# Altium project LimeMM-X8-FMC_1v0.PrjPcb (part 5 of 7)

## Sheet 10_Clock_data_ref.SchDoc: Clock data reference
size A3; Organization: Lime Microsystems; Address1: Surrey Tech Centre; Address2: Guildford GU2 7YG; Address3: Surrey; Address4: United Kingdom; Revision: v1.0; SheetNumber: 10; SheetTotal: 11
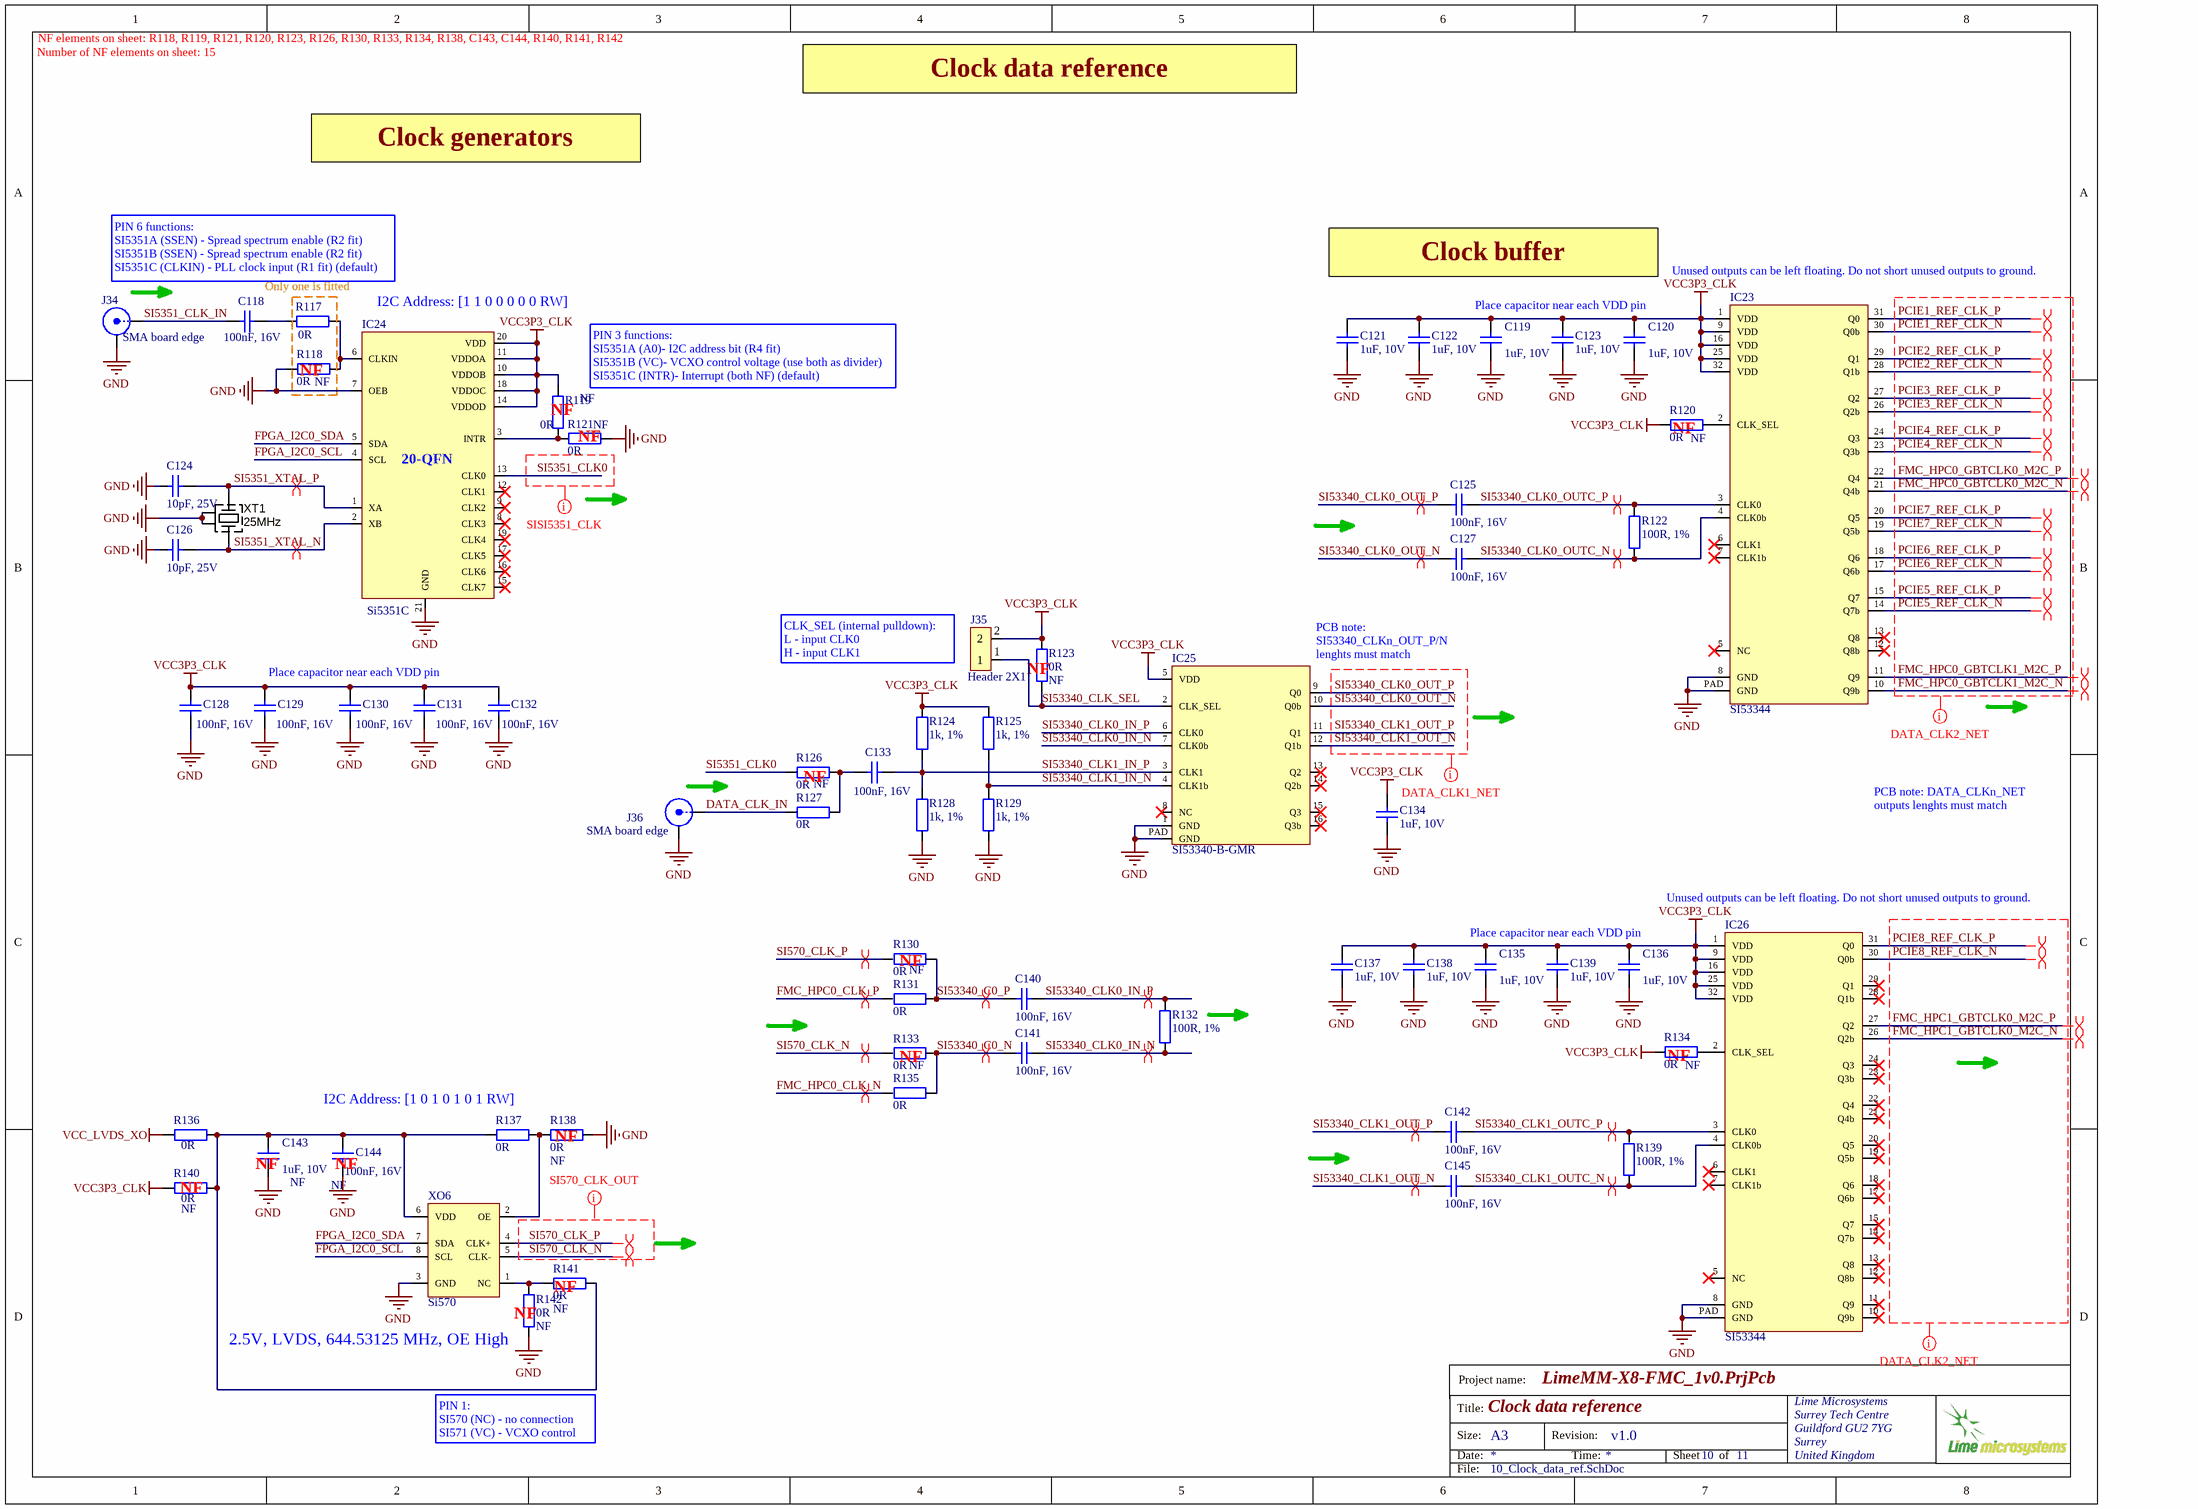
[diagram p9: 10_Clock_data_ref.SchDoc]

### Parts
C118  100nF, 16V  [CAP0402]
C119  1uF, 10V  [CAP0402]
C120  1uF, 10V  [CAP0402]
C121  1uF, 10V  [CAP0402]
C122  1uF, 10V  [CAP0402]
C123  1uF, 10V  [CAP0402]
C124  10pF, 25V  [CAP0402]
C125  100nF, 16V  [CAP0402]
C126  10pF, 25V  [CAP0402]
C127  100nF, 16V  [CAP0402]
C128  100nF, 16V  [CAP0402]
C129  100nF, 16V  [CAP0402]
C130  100nF, 16V  [CAP0402]
C131  100nF, 16V  [CAP0402]
C132  100nF, 16V  [CAP0402]
C133  100nF, 16V  [CAP0402]
C134  1uF, 10V  [CAP0402]
C135  1uF, 10V  [CAP0402]
C136  1uF, 10V  [CAP0402]
C137  1uF, 10V  [CAP0402]
C138  1uF, 10V  [CAP0402]
C139  1uF, 10V  [CAP0402]
C140  100nF, 16V  [CAP0402]
C141  100nF, 16V  [CAP0402]
C142  100nF, 16V  [CAP0402]
C143  1uF, 10V  Assembly Info: NF  [CAP0402]
C144  100nF, 16V  Assembly Info: NF  [CAP0402]
C145  100nF, 16V  [CAP0402]
IC23  SI53344  [SI53344-B-GM_32-VFQFN]
IC24  Si5351C  [Si5351C_20QFN]
IC25  SI53340-B-GMR  [SI53340_QFN16]
IC26  SI53344  [SI53344-B-GM_32-VFQFN]
J34  SMA board edge  [SMA_connector_board_edge_SM]
J35  Header 2X1  [HDR_1x2]
J36  SMA board edge  [SMA_connector_board_edge_SM]
R117  0R  [RES0402]
R118  0R  Assembly Info: NF  [RES0402]
R119  0R  Assembly Info: NF  [RES0402]
R120  0R  Assembly Info: NF  [RES0402]
R121  0R  Assembly Info: NF  [RES0402]
R122  100R, 1%  [RES0402]
R123  0R  Assembly Info: NF  [RES0402]
R124  1k, 1%  [RES0402]
R125  1k, 1%  [RES0402]
R126  0R  Assembly Info: NF  [RES0402]
R127  0R  [RES0402]
R128  1k, 1%  [RES0402]
R129  1k, 1%  [RES0402]
R130  0R  Assembly Info: NF  [RES0402]
R131  0R  [RES0402]
R132  100R, 1%  [RES0402]
R133  0R  Assembly Info: NF  [RES0402]
R134  0R  Assembly Info: NF  [RES0402]
R135  0R  [RES0402]
R136  0R  [RES0402]
R137  0R  [RES0402]
R138  0R  Assembly Info: NF  [RES0402]
R139  100R, 1%  [RES0402]
R140  0R  Assembly Info: NF  [RES0402]
R141  0R  Assembly Info: NF  [RES0402]
R142  0R  Assembly Info: NF  [RES0402]
XO6  Si570  [Si570_Si571_CRYSTAL_8SMD]
XT1  25MHz  [CRYSTAL_4-LCC]

### Nets
GND: C119.1 C120.1 C121.2 C122.2 C123.2 C124.1 C126.1 C128.2 C129.2 C130.2 C131.2 C132.2 C134.2 C135.1 C136.1 C137.2 C138.2 C139.2 C143.1 C144.2 IC23.8(GND) IC23.PAD(GND) IC24.7(OEB) IC24.21(GND) IC25.1(GND) IC25.PAD(GND) IC26.8(GND) IC26.PAD(GND) J34.2(Y) J36.2(Y) R118.2 R121.2 R128.1 R129.1 R138.1 R142.1 XO6.3(GND) XT1.2(GND) XT1.4(GND)
VCC3P3_CLK: C119.2 C120.2 C121.1 C122.1 C123.1 C128.1 C129.1 C130.1 C131.1 C132.1 C134.1 C135.2 C136.2 C137.1 C138.1 C139.1 IC23.1(VDD) IC23.9(VDD) IC23.16(VDD) IC23.25(VDD) IC23.32(VDD) IC24.10(VDDOB) IC24.11(VDDOA) IC24.14(VDDOD) IC24.18(VDDOC) IC24.20(VDD) IC25.5(VDD) IC26.1(VDD) IC26.9(VDD) IC26.16(VDD) IC26.25(VDD) IC26.32(VDD) J35.2 R119.2 R120.1 R123.1 R124.1 R125.1 R134.1 R140.2
VCC_LVDS_XO: R136.2
DATA_CLK_IN: J36.1(X) R127.2
FMC_HPC0_CLK_N: R135.2
FMC_HPC0_CLK_P: R131.2
FMC_HPC0_GBTCLK0_M2C_N: IC23.21(Q4b)
FMC_HPC0_GBTCLK0_M2C_P: IC23.22(Q4)
FMC_HPC0_GBTCLK1_M2C_N: IC23.10(Q9b)
FMC_HPC0_GBTCLK1_M2C_P: IC23.11(Q9)
FMC_HPC1_GBTCLK0_M2C_N: IC26.26(Q2b)
FMC_HPC1_GBTCLK0_M2C_P: IC26.27(Q2)
FPGA_I2C0_SCL: IC24.4(SCL) XO6.8(SCL)
FPGA_I2C0_SDA: IC24.5(SDA) XO6.7(SDA)
PCIE1_REF_CLK_N: IC23.30(Q0b)
PCIE1_REF_CLK_P: IC23.31(Q0)
PCIE2_REF_CLK_N: IC23.28(Q1b)
PCIE2_REF_CLK_P: IC23.29(Q1)
PCIE3_REF_CLK_N: IC23.26(Q2b)
PCIE3_REF_CLK_P: IC23.27(Q2)
PCIE4_REF_CLK_N: IC23.23(Q3b)
PCIE4_REF_CLK_P: IC23.24(Q3)
PCIE5_REF_CLK_N: IC23.14(Q7b)
PCIE5_REF_CLK_P: IC23.15(Q7)
PCIE6_REF_CLK_N: IC23.17(Q6b)
PCIE6_REF_CLK_P: IC23.18(Q6)
PCIE7_REF_CLK_N: IC23.19(Q5b)
PCIE7_REF_CLK_P: IC23.20(Q5)
PCIE8_REF_CLK_N: IC26.30(Q0b)
PCIE8_REF_CLK_P: IC26.31(Q0)
SI570_CLK_N: R133.2 XO6.5(CLK-)
SI570_CLK_P: R130.2 XO6.4(CLK+)
SI5351_CLK0: IC24.13(CLK0) R126.2
SI5351_CLK_IN: C118.1 J34.1(X)
SI5351_XTAL_N: C126.2 IC24.2(XB) XT1.3(X)
SI5351_XTAL_P: C124.2 IC24.1(XA) XT1.1(X)
SI53340_C0_N: C141.1 R133.1 R135.1
SI53340_C0_P: C140.1 R130.1 R131.1
SI53340_CLK0_IN_N: C141.2 IC25.7(CLK0b) R132.1
SI53340_CLK0_IN_P: C140.2 IC25.6(CLK0) R132.2
SI53340_CLK0_OUT_N: C127.1 IC25.10(Q0b)
SI53340_CLK0_OUT_P: C125.1 IC25.9(Q0)
SI53340_CLK0_OUTC_N: C127.2 IC23.4(CLK0b) R122.1
SI53340_CLK0_OUTC_P: C125.2 IC23.3(CLK0) R122.2
SI53340_CLK1_IN_N: IC25.4(CLK1b) R125.2 R129.2
SI53340_CLK1_IN_P: C133.2 IC25.3(CLK1) R124.2 R128.2
SI53340_CLK1_OUT_N: C145.1 IC25.12(Q1b)
SI53340_CLK1_OUT_P: C142.1 IC25.11(Q1)
SI53340_CLK1_OUTC_N: C145.2 IC26.4(CLK0b) R139.1
SI53340_CLK1_OUTC_P: C142.2 IC26.3(CLK0) R139.2
SI53340_CLK_SEL: IC25.2(CLK_SEL) J35.1 R123.2
NetC118_2: C118.2 R117.1
NetC133_1: C133.1 R126.1 R127.1
NetC143_2: C143.2 C144.1 R136.1 R137.2 R140.1 R141.1 XO6.6(VDD)
NetIC23_2: IC23.2(CLK_SEL) R120.2
NetIC24_3: IC24.3(INTR) R119.1 R121.1
NetIC24_6: IC24.6(CLKIN) R117.2 R118.1
NetIC26_2: IC26.2(CLK_SEL) R134.2
NetR137_1: R137.1 R138.2 XO6.2(OE)
NetR141_2: R141.2 R142.2 XO6.1(NC)

Not connected (* = marked no-connect by the designer): IC23 5(NC)* 6(CLK1)* 7(CLK1b)* 12(Q8b)* 13(Q8)*; IC24 8(CLK3)* 9(CLK2)* 12(CLK1)* 15(CLK7)* 16(CLK6)* 17(CLK5)* 19(CLK4)*; IC25 8(NC)* 13(Q2)* 14(Q2b)* 15(Q3)* 16(Q3b)*; IC26 5(NC)* 6(CLK1)* 7(CLK1b)* 10(Q9b)* 11(Q9)* 12(Q8b)* 13(Q8)* 14(Q7b)* 15(Q7)* 17(Q6b)* 18(Q6)* 19(Q5b)* 20(Q5)* 21(Q4b)* 22(Q4)* 23(Q3b)* 24(Q3)* 28(Q1b)* 29(Q1)*

### Layout directives
differential pair: FMC_HPC0_CLK_N, FMC_HPC0_CLK_P, FMC_HPC0_GBTCLK0_M2C_N, FMC_HPC0_GBTCLK0_M2C_P, FMC_HPC0_GBTCLK1_M2C_N, FMC_HPC0_GBTCLK1_M2C_P, FMC_HPC1_GBTCLK0_M2C_N, FMC_HPC1_GBTCLK0_M2C_P, PCIE1_REF_CLK_N, PCIE1_REF_CLK_P, PCIE2_REF_CLK_N, PCIE2_REF_CLK_P, PCIE3_REF_CLK_N, PCIE3_REF_CLK_P, PCIE4_REF_CLK_N, PCIE4_REF_CLK_P, PCIE5_REF_CLK_N, PCIE5_REF_CLK_P, PCIE6_REF_CLK_N, PCIE6_REF_CLK_P, PCIE7_REF_CLK_N, PCIE7_REF_CLK_P, PCIE8_REF_CLK_N, PCIE8_REF_CLK_P, SI570_CLK_N, SI570_CLK_P, SI5351_XTAL_N, SI5351_XTAL_P, SI53340_C0_N, SI53340_C0_P, SI53340_CLK0_IN_N, SI53340_CLK0_IN_P, SI53340_CLK0_OUT_N, SI53340_CLK0_OUT_P, SI53340_CLK0_OUTC_N, SI53340_CLK0_OUTC_P, SI53340_CLK1_OUT_N, SI53340_CLK1_OUT_P, SI53340_CLK1_OUTC_N, SI53340_CLK1_OUTC_P
net class SI_CLK: (no net found under the mark), SI5351_CLK0
net class DATA_CLK1_NET: SI53340_CLK0_OUT_N, SI53340_CLK0_OUT_P, SI53340_CLK1_OUT_N, SI53340_CLK1_OUT_P
net class DATA_CLK2_NET: FMC_HPC0_GBTCLK0_M2C_N, FMC_HPC0_GBTCLK0_M2C_P, FMC_HPC0_GBTCLK1_M2C_N, FMC_HPC0_GBTCLK1_M2C_P, FMC_HPC1_GBTCLK0_M2C_N, FMC_HPC1_GBTCLK0_M2C_P, PCIE1_REF_CLK_N, PCIE1_REF_CLK_P, PCIE2_REF_CLK_N, PCIE2_REF_CLK_P, PCIE3_REF_CLK_N, PCIE3_REF_CLK_P, PCIE4_REF_CLK_N, PCIE4_REF_CLK_P, PCIE5_REF_CLK_N, PCIE5_REF_CLK_P, PCIE6_REF_CLK_N, PCIE6_REF_CLK_P, PCIE7_REF_CLK_N, PCIE7_REF_CLK_P, PCIE8_REF_CLK_N, PCIE8_REF_CLK_P

### Notes on the sheet
- NF elements on sheet: R118, R119, R121, R120, R123, R126, R130, R133, R134, R138, C143, C144, R140, R141, R142
- Number of NF elements on sheet: 15
- Clock data reference
- Clock generators
- PIN 6 functions:
  SI5351A (SSEN) - Spread spectrum enable (R2 fit)
  SI5351B (SSEN) - Spread spectrum enable (R2 fit)
  SI5351C (CLKIN) - PLL clock input (R1 fit) (default)
- Only one is fitted
- I2C Address: [1 1 0 0 0 0 0 RW]
- Clock buffer
- Place capacitor near each VDD pin
- (near IC23) Unused outputs can be left floating. Do not short unused outputs to ground.
- (near R118) NF
- PIN 3 functions:
  SI5351A (A0)- I2C address bit (R4 fit)
  SI5351B (VC)- VCXO control voltage (use both as divider)
  SI5351C (INTR)- Interrupt (both NF) (default)
- (near R119) NF
- (near R121) NF
- (near R120) NF
- CLK_SEL (internal pulldown):
  L - input CLK0
  H - input CLK1
- (near R123) NF
- (near IC25) PCB note: SI53340_CLKn_OUT_P/N lenghts must match
- (near R126) NF
- PCB note: DATA_CLKn_NET outputs lenghts must match
- (near IC26) Unused outputs can be left floating. Do not short unused outputs to ground.
- (near R130) NF
- I2C Address: [1 0 1 0 1 0 1 RW]
- (near R133) NF
- (near R134) NF
- (near R140) NF
- (near C143) NF
- (near C144) NF
- (near R138) NF
- (near R142) NF
- (near R141) NF
- (near R142) 2.5V, LVDS, 644.53125 MHz, OE High
- PIN 1:
  SI570 (NC) - no connection
  SI571 (VC) - VCXO control
- Project name:
- Title:
- Size:
- Date:
- A3
- Revision:
- Time:
- Sheet
- of
- File:
- (in symbol Si5351C) 20-QFN

### Library data of the parts
C118 C125 C127-C133 C140-C142 C144 C145 = Cap_0603: Manufacturer Part Number 1: GRM155R71C104KA88D; Part Description: 0.10µF ±10% 16V X7R Ceramic Capacitor -55°C ~ 125°C Surface Mount, MLCC 0402 (1005 Metric) 0.039" L x 0.020" W (1.00mm x 0.50mm); Brand: Murata Electronics; Tolerance: 10 %; Type: General Purpose MLCC; Capacitance: 0.1 uF; Temperature Coefficient / Code: +/- 15 %; Supplier 1: Mouser; Supplier Part Number 1: 81-GRM155R71C104KA88; Case Code - in: 0402; Manufacturer: Murata Electronics; Category: Multilayer Ceramic Capacitors MLCC - SMD/SMT; Voltage Rating DC: 16 V; Value: 100nF, 16V; Manufacturer Part Number: GRM155R71C104KA88D
C119-C123 C134-C139 C143 = Cap_0402: CAP CER 1UF 10V X5R 0402; Manufacturer: Yageo; Part Description: 1µF 10V Ceramic Capacitor X5R 0402 (1005 Metric) 0.039" L x 0.020" W (1.00mm x 0.50mm); Manufacturer Part Number 1: CC0402MRX5R6BB105; Notification: Current market demand for these product types have resulted in fluctuating and extending lead times. Lead times may differ.; Tolerance: ±20%; Value: 1uF, 10V; Supplier 1: Digi-Key; Supplier Part Number 1: 311-1732-1-ND; RoHS: RoHS Compliant; Applications: General Purpose; Category: Capacitors; ComponentLink1Description: http://www.yageo.com/documents/recent/UPY-GPHC_X5R_4V-to-50V_25.pdf; ComponentLink1URL: http://www.yageo.com/documents/recent/UPY-GPHC_X5R_4V-to-50V_25.pdf; Failure Rate: -; Features: -; Height - Seated (Max): -; Lead Spacing: -; Lead Style: -; Mounting Type: Surface Mount, MLCC; Operating Temperature: -55°C ~ 85°C; Package / Case: 0402 (1005 Metric); Packaging: Cut Tape (CT); Part Status: Active; Pricing 1: 1=0.22, 10=0.156, 100=0.0732, 500=0.0513, 1000=0.04248, 2500=0.03953, 5000=0.03617 (USD); Ratings: -; Size / Dimension: 0.039" L x 0.020" W (1.00mm x 0.50mm); Stock 1: 69600; Temperature Coefficient: X5R; Thickness (Max): 0.022" (0.55mm); Voltage - Rated: 10V
C124 C126 = Cap_0402: Manufacturer: AVX; Part Description: 10pF ±5% 25V C0G, NP0 Ceramic Capacitor -55°C ~ 125°C Surface Mount, MLCC 0402 (1005 Metric) 0.039" L x 0.020" W (1.00mm x 0.50mm); Manufacturer Part Number 1: 04023A100JAT2A; Capacitance: 10; Ceramic Capacitor Case: 0402 [1005 Metric]; Capacitance Tolerance: ± 5%; Supplier 1: Farnell; Supplier Part Number 1: 2332478RL; value: 10pF, 25V
IC23 IC26 = SI53344: Manufacturer: Skyworks Solutions; Manufacturer Part Number 1: SI53344-B-GM; Part Description: Clock Fanout Buffer (Distribution), Multiplexer IC 2:10 1.25 GHz 32-VFQFN Exposed Pad; Supplier 1: Digi-Key; Supplier Part Number 1: 336-3842-ND; Stock 1: 4927; Pricing 1: 1=4,47000, 10=4,01100, 25=3,79200, 80=3,28650, 230=3,11800, 490=2,79776, 980=2,38500 (USD); RoHS: No
IC24 = Si5351C: Manufacturer Part Number 1: SI5351C-B-GM; Part Description: IC CLK GENERATOR 200MHZ 20QFN; Manufacturer: Silicon Labs; Voltage - Supply: 1.71 V ~ 3.6 V; Input: Clock, Crystal; Ratio - Input:Output: 2:8; Frequency - Max: 160MHz; Supplier 1: Digi-Key; Supplier Device Package: 20-QFN (4x4); Type: Clock Generator; Package / Case: 20-VFQFN Exposed Pad; Category: Integrated Circuits (ICs); Supplier Part Number 1: 336-2402-ND
IC25 = SI53340-B-GMR: Clock Fanout Buffer (Distribution), Multiplexer IC 2:4 1.25 GHz 16-VFQFN Exposed Pad; Manufacturer: Skyworks Solutions; Part Description: 2: 4 LVDS buffer (1.25GHz), 2: 1 input mux, (QFN16), footprint compatible: CDCLVP1204; Supplier 1: Digi-Key; Manufacturer Part Number 1: SI53340-B-GMR; Stock 1: 17153; Pricing 1: 1=3,29, 10=2,952, 25=2,7904, 100=2,4184, 250=2,29436, 500=2,05874 (USD); RoHS: No; Supplier Part Number 1: 336-4763-1-ND
J34 J36 = RF_IF_connector: CONN SMA JACK STR 50OHM EDGE MNT; Manufacturer: RF Solutions; Manufacturer Part Number 1: CON-SMA-EDGE-S; Part Description: SMA Connector Jack, Female Socket Board Edge, End Launch Solder; Connector Type: Jack, Female Socket; Contact Termination: Solder; Supplier 1: Digi-Key; Supplier Part Number 1: CON-SMA-EDGE-S-ND; RoHS: RoHS Compliant; Category: Connectors, Interconnects; Stock 1: 1751; Pricing 1: 1=2.1 (USD); Packaging: -; Part Status: Active; Connector Style: SMA; Shield Termination: Solder; Impedance: -; Mounting Type: Board Edge, End Launch; Mounting Feature: -; Cable Group: -; Fastening Type: Threaded; Frequency - Max: -; Features: -; Housing Color: -; Ingress Protection: -; Includes: -; Body Material: -; Body Finish: -; Center Contact Plating: -; Dielectric Material: -; Operating Temperature: -; Center Contact Material: -; Voltage Rating: -; Mating Cycles: -; Insertion Loss: -; ComponentLink1URL: http://media.digikey.com/pdf/Data%20Sheets/RF%20Solutions%20PDFs/CON-SMA-EDGE.pdf; ComponentLink1Description: http://media.digikey.com/pdf/Data%20Sheets/RF%20Solutions%20PDFs/CON-SMA-EDGE.pdf
J35 = Jumper: Manufacturer Part Number 1: 961102-6404-AR; Part Description: 2 Positions Header, Unshrouded Connector 0.100" (2.54mm) Through Hole Gold; Manufacturer: 3M; Connector Type: Header, Unshrouded; Supplier 1: Digi-Key; Supplier Part Number 1: 3M9447-ND; Contact Type: Male Pin; Color: Black; Mounting Type: Through Hole; Category: Connectors, Interconnects; Contact Finish: Gold
R117-R121 R123 R126 R127 R130 R131 R133-R138 R140-R142 = Res_0402: as R36-R43 on sheet 08_Level_conv_misc; Value: 0R; Supplier 1: Digi-Key; Supplier Part Number 1: 311-0.0JRTR-ND; Category: Resistors; Temperature Coefficient: -; Features: Moisture Resistant; Supplier Device Package: 0402; Height: 0.016" (0.40mm); Package / Case: 0402 (1005 Metric); Operating Temperature: -55°C ~ 155°C; Size / Dimension: 0.039" L x 0.020" W (1.00mm x 0.50mm); Composition: Thick Film; Packaging: Tape & Reel (TR); Number of Terminations: 2; RoHS: RoHS Compliant
R122 R132 R139 = Res_0402: Manufacturer Part Number 1: RMCF0402FT100R; Part Description: RES SMD 100 OHM 1% 1/16W 0402; Manufacturer: Stackpole Electronics Inc.; Temperature Coefficient: ±100ppm/°C; Supplier 1: Digi-Key; Supplier Part Number 1: RMCF0402FT100RDKR-ND; Package / Case: 0402 (1005 Metric); Composition: Thick Film; Category: Resistors; Tolerance: ±1%; Value: 100R, 1%
R124 R125 R128 R129 = Res_0402: Manufacturer: Stackpole Electronics Inc; Manufacturer Part Number 1: RMCF0402FT1K00; Part Description: RES SMD 1K OHM 1% 1/16W 0402; Temperature Coefficient: ±100ppm/°C; Power (Watts): 0.063W, 1/16W; Value: 1k, 1%; Supplier 1: Digi-Key; Supplier Part Number 1: RMCF0402FT1K00TR-ND; Resistance (Ohms): 1k; Packaging: Tape & Reel (TR); Category: Resistors; RoHS: RoHS Compliant; Tolerance: ±1%; Height: 0.016" (0.40mm); Number of Terminations: 2; Package / Case: 0402 (1005 Metric); Operating Temperature: -55°C ~ 155°C; Features: -; Composition: Thick Film; Supplier Device Package: 0402; Size / Dimension: 0.039" L x 0.020" W (1.00mm x 0.50mm)
XO6 = SI570: Part Description: 644.53125 MHz XO (Standard) LVDS Oscillator 2.5V Enable/Disable (Reprogrammable) 8-SMD, No Lead; Manufacturer: Silicon Labs; Manufacturer Part Number 1: 570FAA000759DGR; ComponentLink1URL: https://datasheet.ciiva.com/9287/si570-9287030.pdf?src-supplier=Avnet; ComponentLink1Description: https://datasheet.ciiva.com/9287/si570-9287030.pdf?src-supplier=Avnet; Supplier 1: Digi-Key; Supplier Part Number 1: 336-5616-1-ND; Stock 1: 165; Pricing 1: 100=63,45320 (USD); RoHS: Yes
XT1 = CRYSTAL_19M2: Oscillator Crystal 25 MHz; Manufacturer Part Number 1: ABM8-25.000MHZ-B2-T; Manufacturer: ABRACON; Part Description: 25MHz ±20ppm Crystal 18pF 50 Ohm -20°C ~ 70°C Surface Mount 4-SMD, No Lead (DFN, LCC); Supplier 1: Newark; Supplier Part Number 1: 13J1767

## Sheet 11_Power.SchDoc: Power
size A3; Organization: Lime Microsystems; Address1: Surrey Tech Centre; Address2: Guildford GU2 7YG; Address3: Surrey; Address4: United Kingdom; Revision: v1.0; SheetNumber: 11; SheetTotal: 11
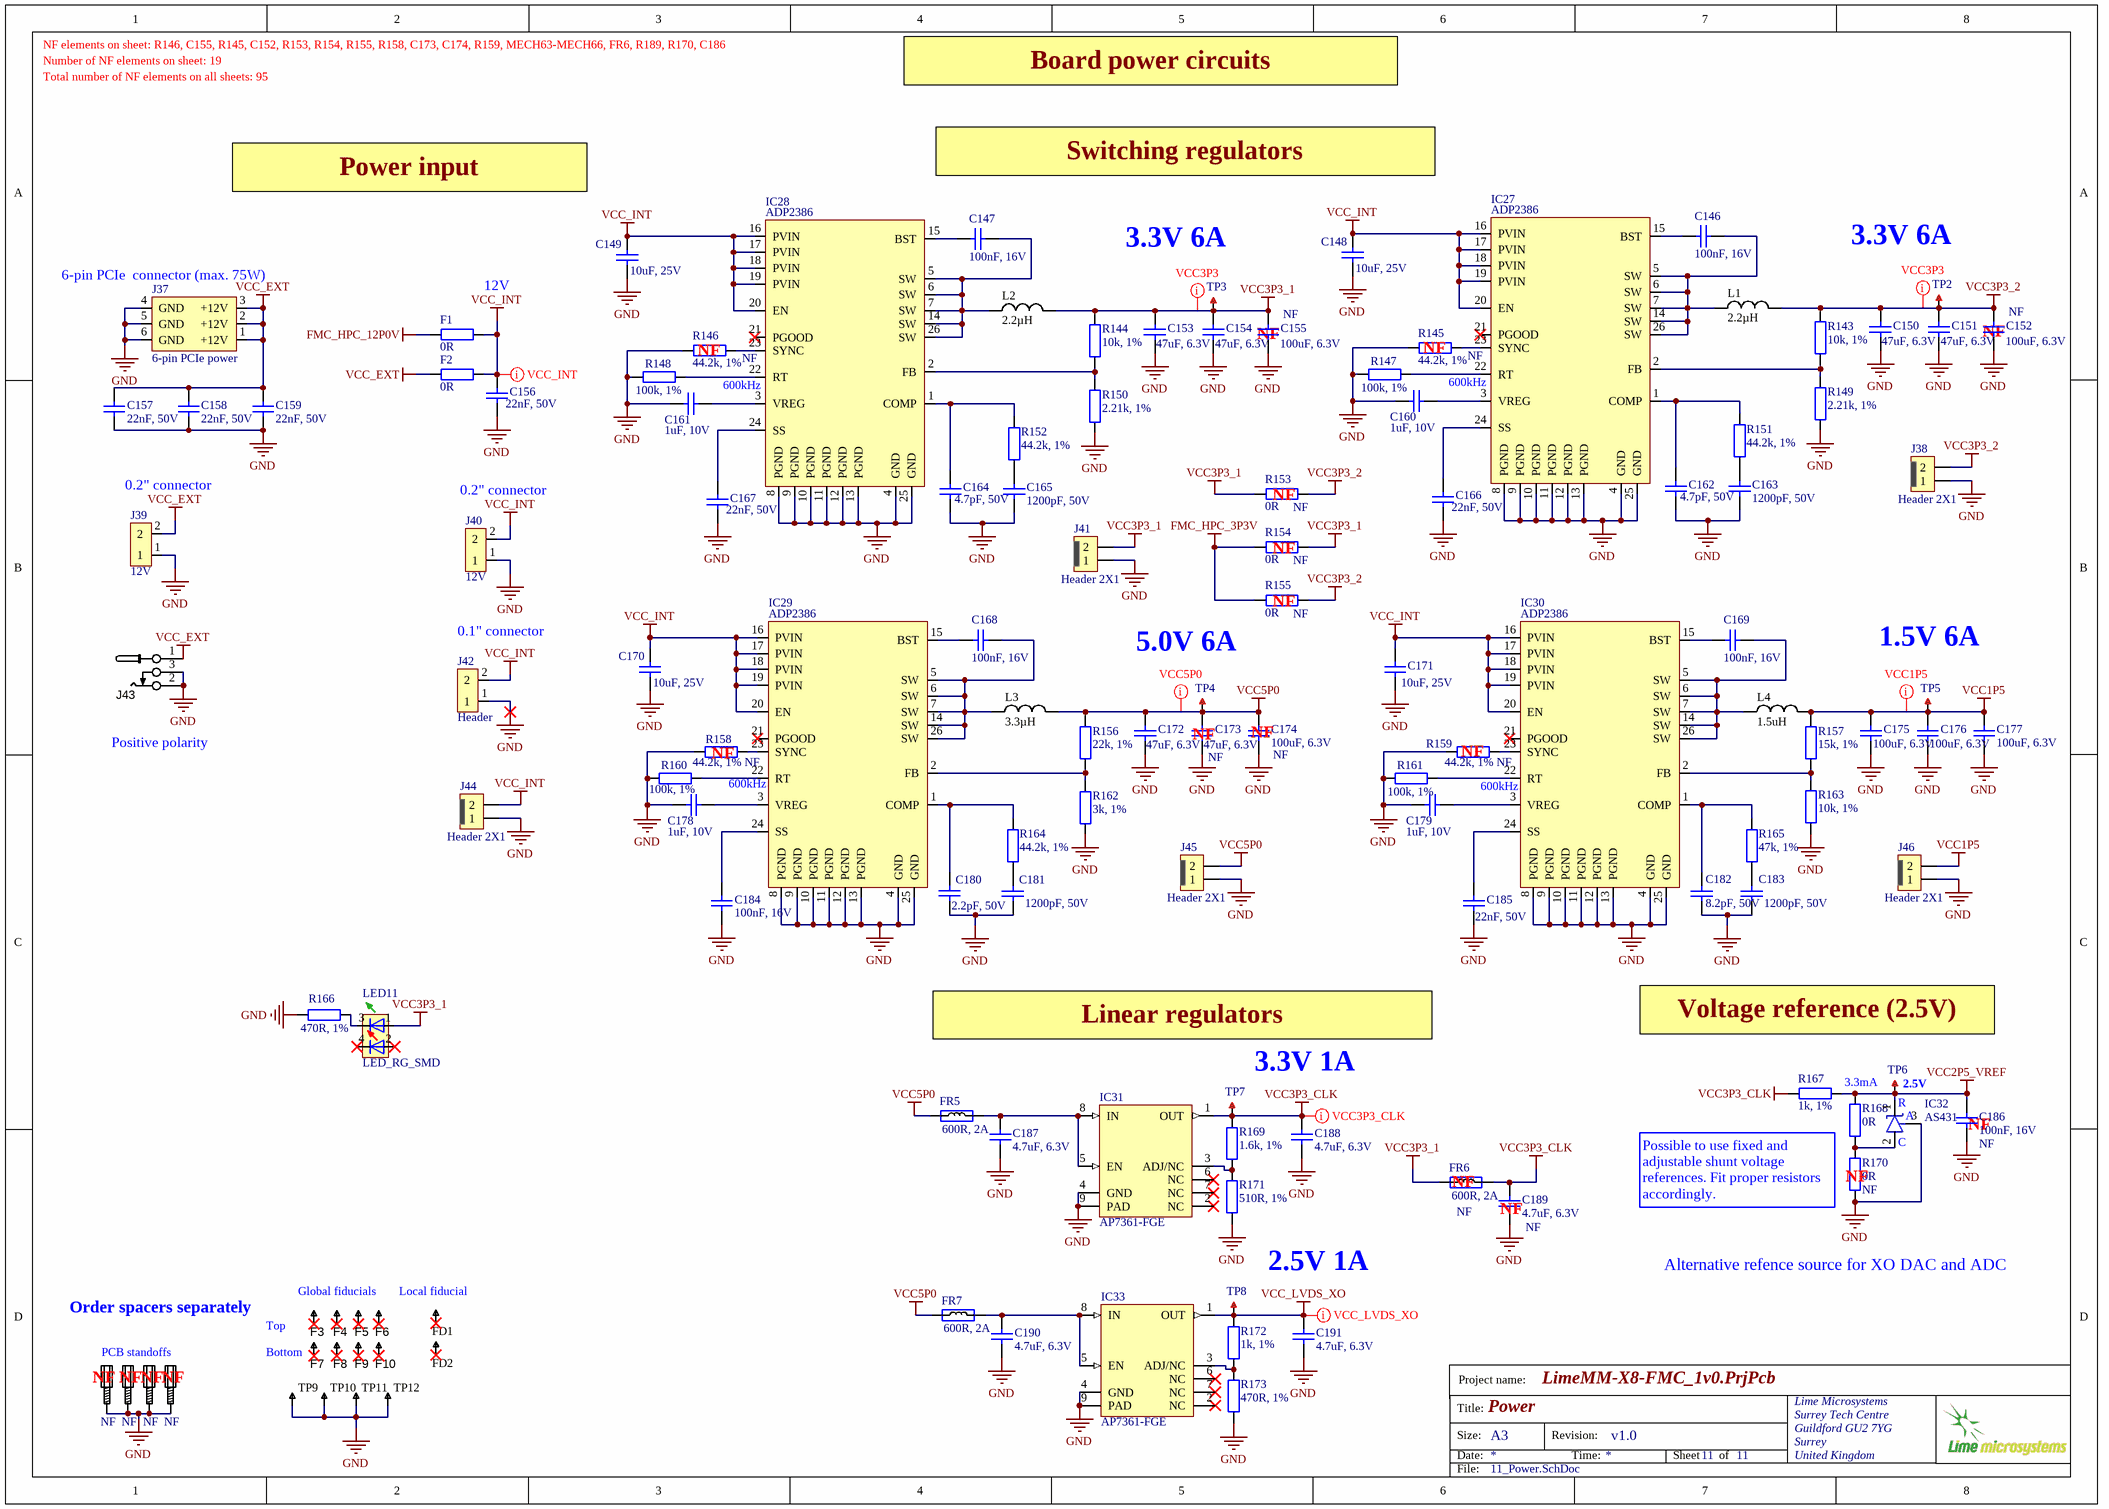
[diagram p10: 11_Power.SchDoc]

### Parts
C146  100nF, 16V  [CAP0402]
C147  100nF, 16V  [CAP0402]
C148  10uF, 25V  [CAP0805]
C149  10uF, 25V  [CAP0805]
C150  47uF, 6.3V  [CAP1206]
C151  47uF, 6.3V  [CAP1206]
C152  100uF, 6.3V  Assembly Info: NF  [CAP1206]
C153  47uF, 6.3V  [CAP1206]
C154  47uF, 6.3V  [CAP1206]
C155  100uF, 6.3V  Assembly Info: NF  [CAP1206]
C156  22nF, 50V  [CAP0402]
C157  22nF, 50V  [CAP0402]
C158  22nF, 50V  [CAP0402]
C159  22nF, 50V  [CAP0402]
C160  1uF, 10V  [CAP0402]
C161  1uF, 10V  [CAP0402]
C162  4.7pF, 50V  [CAP0402]
C163  1200pF, 50V  [CAP0402]
C164  4.7pF, 50V  [CAP0402]
C165  1200pF, 50V  [CAP0402]
C166  22nF, 50V  [CAP0402]
C167  22nF, 50V  [CAP0402]
C168  100nF, 16V  [CAP0402]
C169  100nF, 16V  [CAP0402]
C170  10uF, 25V  [CAP0805]
C171  10uF, 25V  [CAP0805]
C172  47uF, 6.3V  [CAP1206]
C173  47uF, 6.3V  Assembly Info: NF  [CAP1206]
C174  100uF, 6.3V  Assembly Info: NF  [CAP1206]
C175  100uF, 6.3V  [CAP1206]
C176  100uF, 6.3V  [CAP1206]
C177  100uF, 6.3V  [CAP1206]
C178  1uF, 10V  [CAP0402]
C179  1uF, 10V  [CAP0402]
C180  2.2pF, 50V  [CAP0402]
C181  1200pF, 50V  [CAP0402]
C182  8.2pF, 50V  [CAP0402]
C183  1200pF, 50V  [CAP0402]
C184  100nF, 16V  [CAP0402]
C185  22nF, 50V  [CAP0402]
C186  100nF, 16V  Assembly Info: NF  [CAP0402]
C187  4.7uF, 6.3V  [CAP0402]
C188  4.7uF, 6.3V  [CAP0402]
C189  4.7uF, 6.3V  Assembly Info: NF  [CAP0402]
C190  4.7uF, 6.3V  [CAP0402]
C191  4.7uF, 6.3V  [CAP0402]
F1  0R  [RES0805]
F2  0R  [RES0805]
F3  Fiducial  [Fiducial]  (value not drawn)
F4  Fiducial  [Fiducial]  (value not drawn)
F5  Fiducial  [Fiducial]  (value not drawn)
F6  Fiducial  [Fiducial]  (value not drawn)
F7  Fiducial  [Fiducial]  (value not drawn)
F8  Fiducial  [Fiducial]  (value not drawn)
F9  Fiducial  [Fiducial]  (value not drawn)
F10  Fiducial  [Fiducial]  (value not drawn)
FD1  Fiducial  [Fiducial_local]  (value not drawn)
FD2  Fiducial  [Fiducial_local]  (value not drawn)
FR5  600R, 2A  [RES0805]
FR6  600R, 2A  Assembly Info: NF  [RES0805]
FR7  600R, 2A  [RES0805]
IC27  ADP2386  [ADP2386]
IC28  ADP2386  [ADP2386]
IC29  ADP2386  [ADP2386]
IC30  ADP2386  [ADP2386]
IC31  AP7361-FGE  [AP7361]
IC32  AS431  [SOT23-3_v2]
IC33  AP7361-FGE  [AP7361]
J37  6-pin PCIe power  [PCIe_POWER_HEADER_6PIN]
J38  Header 2X1  [Header1x2_TH_LOCKING]
J39  12V  [1744037-2_CONNECTOR_1X2]
J40  12V  [1744037-2_CONNECTOR_1X2]
J41  Header 2X1  [Header1x2_TH_LOCKING]
J42  Header  [HDR_1x2]
J43  CONN_PWR_JACK_2.1x5.5mm  [CONN_PWR_JACK_v2]  (value not drawn)
J44  Header 2X1  [Header1x2_TH_LOCKING]
J45  Header 2X1  [Header1x2_TH_LOCKING]
J46  Header 2X1  [Header1x2_TH_LOCKING]
L1  2.2µH  [FDVE1040_TOKO_INDUCTOR]
L2  2.2µH  [FDVE1040_TOKO_INDUCTOR]
L3  3.3µH  [FDVE1040_TOKO_INDUCTOR]
L4  1.5uH  [FDVE1040_TOKO_INDUCTOR]
LED11  LED_RG_SMD  [LED-2x0603]
MECH63  Assembly Info: NF  [PCB_standoff]  (hidden comment: # pcs.)
MECH64  Assembly Info: NF  [PCB_standoff]  (hidden comment: # pcs.)
MECH65  Assembly Info: NF  [PCB_standoff]  (hidden comment: # pcs.)
MECH66  Assembly Info: NF  [PCB_standoff]  (hidden comment: # pcs.)
R143  10k, 1%  [RES0402]
R144  10k, 1%  [RES0402]
R145  44.2k, 1%  Assembly Info: NF  [RES0402]
R146  44.2k, 1%  Assembly Info: NF  [RES0402]
R147  100k, 1%  [RES0402]
R148  100k, 1%  [RES0402]
R149  2.21k, 1%  [RES0402]
R150  2.21k, 1%  [RES0402]
R151  44.2k, 1%  [RES0402]
R152  44.2k, 1%  [RES0402]
R153  0R  Assembly Info: NF  [RES0805]
R154  0R  Assembly Info: NF  [RES0805]
R155  0R  Assembly Info: NF  [RES0805]
R156  22k, 1%  [RES0402]
R157  15k, 1%  [RES0402]
R158  44.2k, 1%  Assembly Info: NF  [RES0402]
R159  44.2k, 1%  Assembly Info: NF  [RES0402]
R160  100k, 1%  [RES0402]
R161  100k, 1%  [RES0402]
R162  3k, 1%  [RES0402]
R163  10k, 1%  [RES0402]
R164  44.2k, 1%  [RES0402]
R165  47k, 1%  [RES0402]
R166  470R, 1%  [RES0402]
R167  1k, 1%  [RES0402]
R168  0R  [RES0402]
R169  1.6k, 1%  [RES0402]
R170  0R  Assembly Info: NF  [RES0402]
R171  510R, 1%  [RES0402]
R172  1k, 1%  [RES0402]
R173  470R, 1%  [RES0402]
TP2  TESTPOINT_PAD  [TP_PAD_1p5MM]  (value not drawn)  (no BOM)
TP3  TESTPOINT_PAD  [TP_PAD_1p5MM]  (value not drawn)  (no BOM)
TP4  TESTPOINT_PAD  [TP_PAD_1p5MM]  (value not drawn)  (no BOM)
TP5  TESTPOINT_PAD  [TP_PAD_1p5MM]  (value not drawn)  (no BOM)
TP6  TESTPOINT_PAD  [TP_PAD_1p5MM]  (value not drawn)  (no BOM)
TP7  TESTPOINT_PAD  [TP_PAD_1p5MM]  (value not drawn)  (no BOM)
TP8  TESTPOINT_PAD  [TP_PAD_1p5MM]  (value not drawn)  (no BOM)
TP9  TESTPOINT_THT_MINI  [TP-SMD-LOW_PROFILE]  (value not drawn)
TP10  TESTPOINT_THT_MINI  [TP-SMD-LOW_PROFILE]  (value not drawn)
TP11  TESTPOINT_THT_MINI  [TP-SMD-LOW_PROFILE]  (value not drawn)
TP12  TESTPOINT_THT_MINI  [TP-SMD-LOW_PROFILE]  (value not drawn)

### Nets
FMC_HPC_3P3V: R154.2 R155.2
FMC_HPC_12P0V: F1.2
GND: C148.1 C149.1 C150.1 C151.1 C152.1 C153.1 C154.1 C155.1 C156.2 C157.2 C158.2 C159.2 C160.2 C161.2 C162.2 C163.2 C164.2 C165.2 C166.2 C167.2 C170.1 C171.1 C172.1 C173.1 C174.1 C175.1 C176.1 C177.1 C178.2 C179.2 C180.2 C181.2 C182.2 C183.2 C184.1 C185.2 C186.1 C187.1 C188.1 C189.1 C190.1 C191.1 IC27.4(GND) IC27.8(PGND) IC27.9(PGND) IC27.10(PGND) IC27.11(PGND) IC27.12(PGND) IC27.13(PGND) IC27.25(GND) IC28.4(GND) IC28.8(PGND) IC28.9(PGND) IC28.10(PGND) IC28.11(PGND) IC28.12(PGND) IC28.13(PGND) IC28.25(GND) IC29.4(GND) IC29.8(PGND) IC29.9(PGND) IC29.10(PGND) IC29.11(PGND) IC29.12(PGND) IC29.13(PGND) IC29.25(GND) IC30.4(GND) IC30.8(PGND) IC30.9(PGND) IC30.10(PGND) IC30.11(PGND) IC30.12(PGND) IC30.13(PGND) IC30.25(GND) IC31.4(GND) IC31.9(PAD) IC32.3(NC/A) IC33.4(GND) IC33.9(PAD) J37.4(GND) J37.5(GND) J37.6(GND) J38.1 J39.1 J40.1 J41.1 J42.1 J43.2 J43.3 J44.1 J45.1 J46.1 MECH63.MH1 MECH64.MH1 MECH65.MH1 MECH66.MH1 R145.2 R146.2 R147.2 R148.2 R149.1 R150.1 R158.2 R159.2 R160.2 R161.2 R162.1 R163.2 R166.2 R170.2 R171.2 R173.2 TP9.1 TP10.1 TP11.1 TP12.1
VCC1P5: C175.2 C176.2 C177.2 J46.2 L4.2 R157.2 TP5.1
VCC2P5_VREF: C186.2 IC32.1(K) R167.1 R168.1 TP6.1
VCC3P3_1: C153.2 C154.2 C155.2 FR6.1 J41.2 L2.2 LED11.1 R144.1 R153.2 R154.1 TP3.1
VCC3P3_2: C150.2 C151.2 C152.2 J38.2 L1.2 R143.1 R153.1 R155.1 TP2.1
VCC3P3_CLK: C188.2 C189.2 FR6.2 IC31.1(OUT) R167.2 R169.2 TP7.1
VCC5P0: C172.2 C173.2 C174.2 FR5.1 FR7.1 J45.2 L3.2 R156.2 TP4.1
VCC_EXT: C157.1 C158.1 C159.1 F2.2 J37.1(+12V) J37.2(+12V) J37.3(+12V) J39.2 J43.1
VCC_INT: C148.2 C149.2 C156.1 C170.2 C171.2 F1.1 F2.1 IC27.16(PVIN) IC27.17(PVIN) IC27.18(PVIN) IC27.19(PVIN) IC27.20(EN) IC28.16(PVIN) IC28.17(PVIN) IC28.18(PVIN) IC28.19(PVIN) IC28.20(EN) IC29.16(PVIN) IC29.17(PVIN) IC29.18(PVIN) IC29.19(PVIN) IC29.20(EN) IC30.16(PVIN) IC30.17(PVIN) IC30.18(PVIN) IC30.19(PVIN) IC30.20(EN) J40.2 J42.2 J44.2
VCC_LVDS_XO: C191.2 IC33.1(OUT) R172.2 TP8.1
NetC146_1: C146.1 IC27.15(BST)
NetC146_2: C146.2 IC27.5(SW) IC27.6(SW) IC27.7(SW) IC27.14(SW) IC27.26(SW) L1.1
NetC147_1: C147.1 IC28.15(BST)
NetC147_2: C147.2 IC28.5(SW) IC28.6(SW) IC28.7(SW) IC28.14(SW) IC28.26(SW) L2.1
NetC160_1: C160.1 IC27.3(VREG)
NetC161_1: C161.1 IC28.3(VREG)
NetC162_1: C162.1 IC27.1(COMP) R151.2
NetC163_1: C163.1 R151.1
NetC164_1: C164.1 IC28.1(COMP) R152.2
NetC165_1: C165.1 R152.1
NetC166_1: C166.1 IC27.24(SS)
NetC167_1: C167.1 IC28.24(SS)
NetC168_1: C168.1 IC29.15(BST)
NetC168_2: C168.2 IC29.5(SW) IC29.6(SW) IC29.7(SW) IC29.14(SW) IC29.26(SW) L3.1
NetC169_1: C169.1 IC30.15(BST)
NetC169_2: C169.2 IC30.5(SW) IC30.6(SW) IC30.7(SW) IC30.14(SW) IC30.26(SW) L4.1
NetC178_1: C178.1 IC29.3(VREG)
NetC179_1: C179.1 IC30.3(VREG)
NetC180_1: C180.1 IC29.1(COMP) R164.2
NetC181_1: C181.1 R164.1
NetC182_1: C182.1 IC30.1(COMP) R165.2
NetC183_1: C183.1 R165.1
NetC184_2: C184.2 IC29.24(SS)
NetC185_1: C185.1 IC30.24(SS)
NetC187_2: C187.2 FR5.2 IC31.5(EN) IC31.8(IN)
NetC190_2: C190.2 FR7.2 IC33.5(EN) IC33.8(IN)
NetIC27_2: IC27.2(FB) R143.2 R149.2
NetIC27_22: IC27.22(RT) R147.1
NetIC27_23: IC27.23(SYNC) R145.1
NetIC28_2: IC28.2(FB) R144.2 R150.2
NetIC28_22: IC28.22(RT) R148.1
NetIC28_23: IC28.23(SYNC) R146.1
NetIC29_2: IC29.2(FB) R156.1 R162.2
NetIC29_22: IC29.22(RT) R160.1
NetIC29_23: IC29.23(SYNC) R158.1
NetIC30_2: IC30.2(FB) R157.1 R163.1
NetIC30_22: IC30.22(RT) R161.1
NetIC30_23: IC30.23(SYNC) R159.1
NetIC31_3: IC31.3(ADJ/NC) R169.1 R171.1
NetIC32_2: IC32.2(A) R168.2 R170.1
NetIC33_3: IC33.3(ADJ/NC) R172.1 R173.1
NetLED11_3: LED11.3 R166.1

Not connected (* = marked no-connect by the designer): F3 1*; F4 1*; F5 1*; F6 1*; F7 1*; F8 1*; F9 1*; F10 1*; FD1 1*; FD2 1*; IC27 21(PGOOD)*; IC28 21(PGOOD)*; IC29 21(PGOOD)*; IC30 21(PGOOD)*; IC31 2(NC)* 6(NC)* 7(NC)*; IC33 2(NC)* 6(NC)* 7(NC)*; LED11 2* 4*

### Layout directives
net class VCC3P3_CLK: VCC3P3_CLK
net class VCC3P3: VCC3P3_1, VCC3P3_2
net class VCC5P0: VCC5P0
net class VCC1P5: VCC1P5
net class VCC_INT: VCC_INT
net class VCC_LVDS_XO: VCC_LVDS_XO

### Notes on the sheet
- NF elements on sheet: R146, C155, R145, C152, R153, R154, R155, R158, C173, C174, R159, MECH63-MECH66, FR6, R189, R170, C186
- Number of NF elements on sheet: 19
- Total number of NF elements on all sheets: 95
- Board power circuits
- Switching regulators
- Power input
- (near TP3) 3.3V 6A
- (near TP2) 3.3V 6A
- (near J37) 6-pin PCIe  connector (max. 75W)
- (near F1) 12V
- (near R146) NF
- (near C155) NF
- (near R145) NF
- (near C152) NF
- (near IC28) 600kHz
- (near IC27) 600kHz
- 0.2" connector
- (near J40) 0.2" connector
- (near R153) NF
- (near R154) NF
- 0.1" connector
- 5.0V 6A
- (near R155) NF
- (near TP5) 1.5V 6A
- (near J43) Positive polarity
- (near R158) NF
- (near IC29) 600kHz
- (near C173) NF
- (near C174) NF
- (near R159) NF
- (near IC30) 600kHz
- Linear regulators
- Voltage reference (2.5V)
- 3.3V 1A
- 3.3mA
- (near IC32) R
- (near TP6) 2.5V
- (near IC32) A
- (near FR6) NF
- (near R170) NF
- (near IC32) C
- (near C186) NF
- (near C189) NF
- Possible to use fixed and adjustable shunt voltage references. Fit proper resistors accordingly.
- Order spacers separately
- Top
- Global fiducials
- (near FD1) Local fiducial
- 2.5V 1A
- Alternative refence source for XO DAC and ADC
- NF
- PCB standoffs
- (near F7) Bottom
- Project name:
- Title:
- Size:
- Date:
- A3
- Revision:
- Time:
- Sheet
- of
- File: